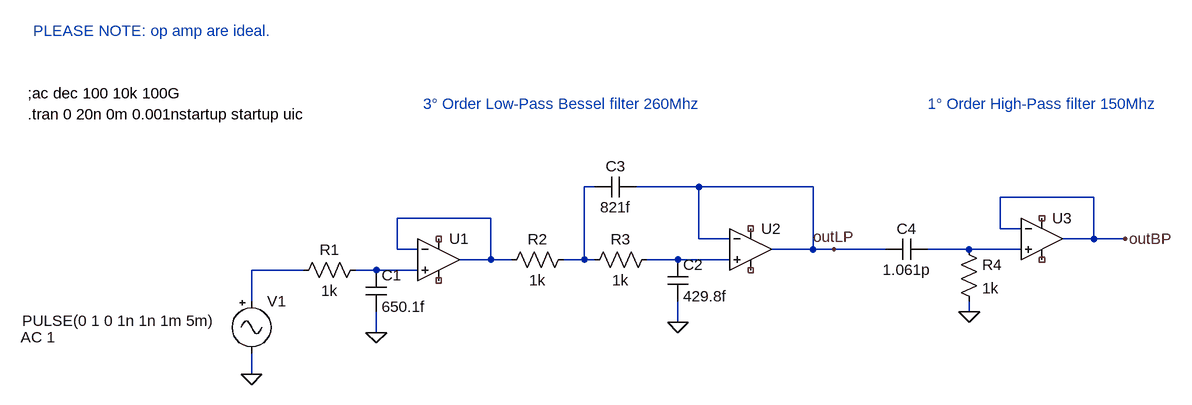
[diagram p0: schematic Sallen-Key_3_LP_Bessel_1_HP.asc]
Sallen-Key_3_LP_Bessel_1_HP.asc, the LTspice schematic file:
Version 4
SHEET 1 1400 680
WIRE 496 -112 480 -112
WIRE 656 -112 560 -112
WIRE 832 -112 656 -112
WIRE 1264 -96 1120 -96
WIRE 336 -64 192 -64
WIRE 1120 -48 1120 -96
WIRE 1152 -48 1120 -48
WIRE 656 -32 656 -112
WIRE 704 -32 656 -32
WIRE 1264 -32 1264 -96
WIRE 1264 -32 1216 -32
WIRE 1312 -32 1264 -32
WIRE 192 -16 192 -64
WIRE 224 -16 192 -16
WIRE 832 -16 832 -112
WIRE 832 -16 768 -16
WIRE 864 -16 832 -16
WIRE 944 -16 864 -16
WIRE 1072 -16 1008 -16
WIRE 1152 -16 1072 -16
WIRE 336 0 336 -64
WIRE 336 0 288 0
WIRE 368 0 336 0
WIRE 480 0 480 -112
WIRE 480 0 448 0
WIRE 496 0 480 0
WIRE 624 0 576 0
WIRE 704 0 624 0
WIRE 48 16 -32 16
WIRE 160 16 128 16
WIRE 224 16 160 16
WIRE -32 64 -32 16
WIRE 1072 80 1072 64
WIRE 624 96 624 64
WIRE 160 112 160 80
WIRE -32 176 -32 144
FLAG -32 176 0
FLAG 160 112 0
FLAG 624 96 0
FLAG 864 -16 outLP
FLAG 1072 80 0
FLAG 1312 -32 outBP
SYMBOL Misc\\signal -32 48 R0
WINDOW 3 -353 46 Left 2
WINDOW 123 -355 71 Left 2
WINDOW 39 0 0 Left 0
SYMATTR Value PULSE(0 1 0 1n 1n 1m 5m)
SYMATTR Value2 AC 1
SYMATTR InstName V1
SYMBOL OpAmps\\UniversalOpamp2 256 0 R0
SYMATTR InstName U1
SYMATTR SpiceModel level1
SYMATTR Value2 Avol=100G GBW=10000G Slew=1000G
SYMATTR SpiceLine2 En=0 Enk=0 In=0 Ink=0 Rin=500Meg Ro=50 Ccm=1f Cdiff=1f
SYMBOL res 144 0 R90
WINDOW 0 0 56 VBottom 2
WINDOW 3 32 56 VTop 2
SYMATTR InstName R1
SYMATTR Value 1k
SYMBOL cap 144 16 R0
SYMATTR InstName C1
SYMATTR Value 650.1f
SYMBOL res 464 -16 R90
WINDOW 0 0 56 VBottom 2
WINDOW 3 32 56 VTop 2
SYMATTR InstName R2
SYMATTR Value 1k
SYMBOL res 592 -16 R90
WINDOW 0 0 56 VBottom 2
WINDOW 3 32 56 VTop 2
SYMATTR InstName R3
SYMATTR Value 1k
SYMBOL cap 608 0 R0
SYMATTR InstName C2
SYMATTR Value 429.8f
SYMBOL cap 560 -128 R90
WINDOW 0 0 32 VBottom 2
WINDOW 3 32 32 VTop 2
SYMATTR InstName C3
SYMATTR Value 821f
SYMBOL OpAmps\\UniversalOpamp2 736 -16 R0
SYMATTR InstName U2
SYMATTR SpiceModel level1
SYMATTR Value2 Avol=100G GBW=10000G Slew=1000G
SYMATTR SpiceLine2 En=0 Enk=0 In=0 Ink=0 Rin=500Meg Ro=50 Ccm=1f Cdiff=1f
SYMBOL cap 1008 -32 R90
WINDOW 0 0 32 VBottom 2
WINDOW 3 32 32 VTop 2
SYMATTR InstName C4
SYMATTR Value 1.061p
SYMBOL res 1056 -32 R0
SYMATTR InstName R4
SYMATTR Value 1k
SYMBOL OpAmps\\UniversalOpamp2 1184 -32 R0
SYMATTR InstName U3
SYMATTR SpiceModel level1
SYMATTR Value2 Avol=100G GBW=10000G Slew=1000G
SYMATTR SpiceLine2 En=0 Enk=0 In=0 Ink=0 Rin=500Meg Ro=50 Ccm=1f Cdiff=1f
TEXT -376 -256 Left 2 !;ac dec 100 10k 100G
TEXT -376 -224 Left 2 !.tran 0 20n 0m 0.001nstartup startup uic
TEXT 232 -240 Left 2 ;3° Order Low-Pass Bessel filter 260Mhz
TEXT 1008 -240 Left 2 ;1° Order High-Pass filter 150Mhz
TEXT -368 -352 Left 2 ;PLEASE NOTE: op amp are ideal.

The netlist it stands for:
* Sallen-Key_3_LP_Bessel_1_HP.asc
V1 N005 0 PULSE(0 1 0 1n 1n 1m 5m) AC 1
XU1 N006 N002 NC_01 NC_02 N002 level1 Avol=100G GBW=10000G Slew=1000G Ilimit=25m Rail=0 Vos=0 En=0 Enk=0 In=0 Ink=0 Rin=500Meg Ro=50 Ccm=1f Cdiff=1f  ; pins In+ In- V+ V- OUT
R1 N006 N005 1k
C1 N006 0 650.1f
R2 N001 N002 1k
R3 N004 N001 1k
C2 N004 0 429.8f
C3 outLP N001 821f
XU2 N004 outLP NC_03 NC_04 outLP level1 Avol=100G GBW=10000G Slew=1000G Ilimit=25m Rail=0 Vos=0 En=0 Enk=0 In=0 Ink=0 Rin=500Meg Ro=50 Ccm=1f Cdiff=1f  ; pins In+ In- V+ V- OUT
C4 N003 outLP 1.061p
R4 N003 0 1k
XU3 N003 outBP NC_05 NC_06 outBP level1 Avol=100G GBW=10000G Slew=1000G Ilimit=25m Rail=0 Vos=0 En=0 Enk=0 In=0 Ink=0 Rin=500Meg Ro=50 Ccm=1f Cdiff=1f  ; pins In+ In- V+ V- OUT
;ac dec 100 10k 100G
.tran 0 20n 0m 0.001nstartup startup uic
* 3° Order Low-Pass Bessel filter 260Mhz
* 1° Order High-Pass filter 150Mhz
* PLEASE NOTE: op amp are ideal.
.lib UniversalOpAmp2.lib
.backanno
.end